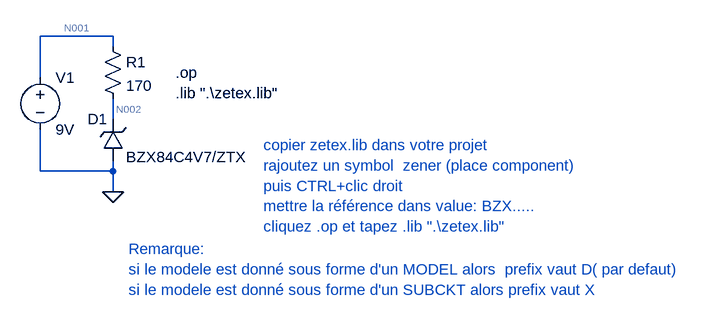
[diagram p0: schematic Zener.asc]
Zener.asc, the LTspice schematic file:
Version 4
SHEET 1 1016 680
WIRE -32 48 -144 48
WIRE -32 64 -32 48
WIRE -144 112 -144 48
WIRE -32 176 -32 144
WIRE -144 256 -144 192
WIRE -32 256 -32 240
WIRE -32 256 -144 256
WIRE -32 288 -32 256
FLAG -32 288 0
SYMBOL res -48 48 R0
SYMATTR InstName R1
SYMATTR Value 170
SYMBOL voltage -144 96 R0
SYMATTR InstName V1
SYMATTR Value 9V
SYMBOL zener -16 240 R180
WINDOW 0 24 64 Left 2
WINDOW 3 -190 6 Left 2
SYMATTR InstName D1
SYMATTR Value BZX84C4V7/ZTX
TEXT 64 104 Left 2 !.op
TEXT 64 136 Left 2 !.lib ".\\zetex.lib"
TEXT 200 216 Left 2 ;copier zetex.lib dans votre projet\nrajoutez un symbol  zener (place component)\npuis CTRL+clic droit\nmettre la référence dans value: BZX.....\ncliquez .op et tapez .lib ".\\zetex.lib"
TEXT -8 376 Left 2 ;Remarque:\nsi le modele est donné sous forme d'un MODEL alors  prefix vaut D( par defaut)\nsi le modele est donné sous forme d'un SUBCKT alors prefix vaut X

The netlist it stands for:
* Zener.asc
R1 N001 N002 170
V1 N001 0 9V
D1 0 N002 BZX84C4V7/ZTX
.model D D
.lib standard.dio
.op
.lib ".\zetex.lib"
* copier zetex.lib dans votre projet
* rajoutez un symbol  zener (place component)
* puis CTRL+clic droit
* mettre la référence dans value: BZX.....
* cliquez .op et tapez .lib ".\zetex.lib"
* Remarque:
* si le modele est donné sous forme d'un MODEL alors  prefix vaut D( par defaut)
* si le modele est donné sous forme d'un SUBCKT alors prefix vaut X
.backanno
.end

* Results of the author's LTspice run, read from the files saved beside the schematic
* Operating Point:
*   V(n001) = 9 V
*   V(n002) = 4.744 V
*   I(D1) = -25.03 mA
*   I(R1) = 25.03 mA
*   I(V1) = -25.03 mA
* From the log:
*   Semiconductor Device Operating Points:
*                           --- Diodes ---
*   Name:       d1
*   Model: bzx84c4v7/ztx
*   Id:      -2.50e-02
*   Vd:      -4.74e+00
*   Req:      1.03e+00
*   CAP:      5.73e-07